# Altium schematic sheet top.SchDoc
size A; PageSetup: Record=PageOptions|CenterHorizontal=True|CenterVertical=True|PrintScale=1.09|XCorrection=1.00|YCorrection=1.00|PrintKind=2|BorderSize=5000000|LeftOffset=0|BottomOffset=0|Orientation=2|PaperLength=1000|PaperWidth=1000|Scale=100|PaperSource=7|PrintQuality=-4|MediaType=1|DitherType=10|PaperKind=A4|PrintScaleMode=1
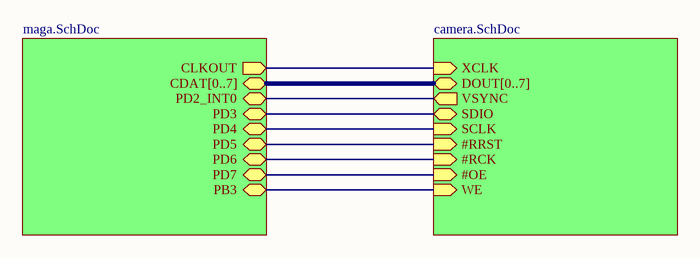
[diagram p0: top.SchDoc]

## Sub-sheets
Designator = camera.SchDoc: DOUT[0..7] (bidir), #RRST (in), #RCK (in), #OE (in), SDIO (bidir), SCLK (in), XCLK (in), VSYNC (out), WE (in)
Designator = maga.SchDoc: CDAT[0..7] (bidir), PD7 (bidir), PD6 (bidir), PD5 (bidir), PD4 (bidir), PD2_INT0 (bidir), PB3 (bidir), PD3 (bidir), CLKOUT (out)

## Nets
(unnamed): sheet Designator/#RRST, sheet Designator/PD5
(unnamed): sheet Designator/#RCK, sheet Designator/PD6
(unnamed): sheet Designator/#OE, sheet Designator/PD7
(unnamed): sheet Designator/SDIO, sheet Designator/PD3
(unnamed): sheet Designator/SCLK, sheet Designator/PD4
(unnamed): sheet Designator/XCLK, sheet Designator/CLKOUT
(unnamed): sheet Designator/VSYNC, sheet Designator/PD2_INT0
(unnamed): sheet Designator/WE, sheet Designator/PB3

## Buses and harness runs
bus sheet Designator/CDAT[0..7] = sheet Designator/DOUT[0..7]